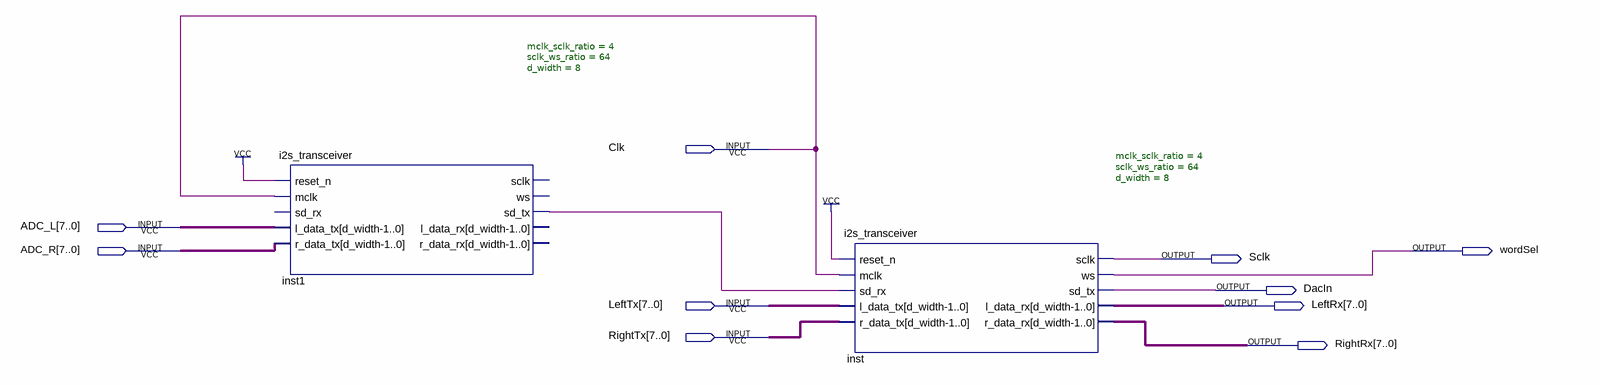
[diagram p0: schematic sheet]
// Quartus schematic i2s_tb.bdf as structural Verilog: 2 symbols, 10 pins
module i2s_tb (
  input  Clk,
  input  [7:0] ADC_L,
  input  [7:0] ADC_R,
  input  [7:0] LeftTx,
  input  [7:0] RightTx,
  output wordSel,
  output Sclk,
  output DacIn,
  output [7:0] LeftRx,
  output [7:0] RightRx
);

  wire inst1_sd_tx;

  i2s_transceiver #(.mclk_sclk_ratio(4), .sclk_ws_ratio(64), .d_width(8)) inst1 (
    .reset_n(1'b1), .mclk(Clk), .l_data_tx(ADC_L), .r_data_tx(ADC_R), .sd_tx(inst1_sd_tx));  // open: sd_rx, sclk, ws, l_data_rx, r_data_rx
  i2s_transceiver #(.mclk_sclk_ratio(4), .sclk_ws_ratio(64), .d_width(8)) inst (
    .reset_n(1'b1), .mclk(Clk), .sd_rx(inst1_sd_tx), .l_data_tx(LeftTx), .r_data_tx(RightTx), .sclk(Sclk),
    .ws(wordSel), .sd_tx(DacIn), .l_data_rx(LeftRx), .r_data_rx(RightRx));
endmodule
